# Altium project RelayBoard.PrjPcb
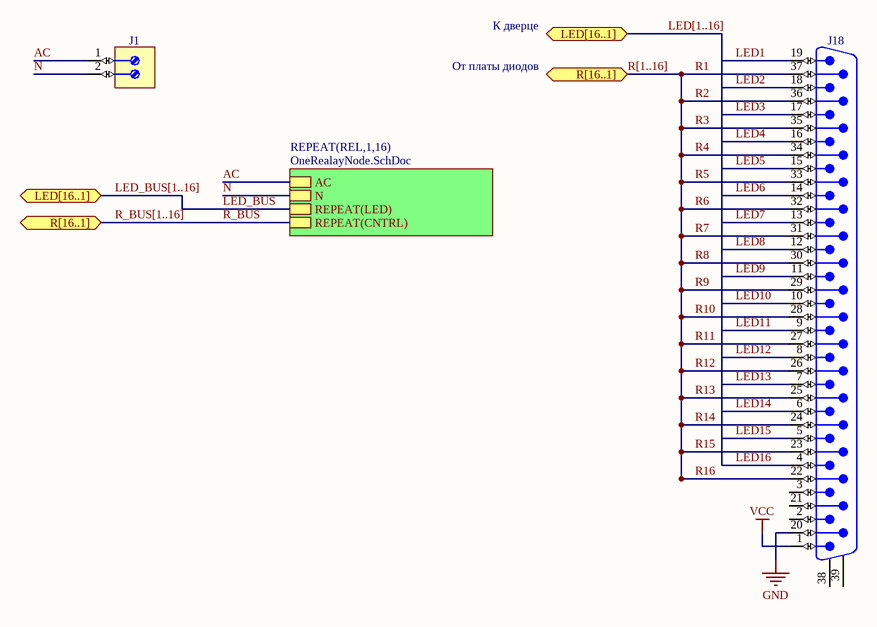
[diagram p0: RelayBoard.SchDoc]
2 sheets, 146 parts. Net scope: hierarchical (ports join the sheet entries above them; power ports are global).
Board file: RelayBoard.PcbDoc
Sheets:
  RelayBoard.SchDoc
    REL1 = OneRealayNode.SchDoc
    REL2 = OneRealayNode.SchDoc
    REL3 = OneRealayNode.SchDoc
    REL4 = OneRealayNode.SchDoc
    REL5 = OneRealayNode.SchDoc
    REL6 = OneRealayNode.SchDoc
    REL7 = OneRealayNode.SchDoc
    REL8 = OneRealayNode.SchDoc
    REL9 = OneRealayNode.SchDoc
    REL10 = OneRealayNode.SchDoc
    REL11 = OneRealayNode.SchDoc
    REL12 = OneRealayNode.SchDoc
    REL13 = OneRealayNode.SchDoc
    REL14 = OneRealayNode.SchDoc
    REL15 = OneRealayNode.SchDoc
    REL16 = OneRealayNode.SchDoc

## Sheet RelayBoard.SchDoc
size A1

### Parts
J1  Terminal  [WIELAND_25.161.0253.0]  (value not drawn)
J18  D-Sub  [AMPHENOL_L717DFC37P1ATN]  (value not drawn)

### Sub-sheets
REPEAT(REL,1,16) = OneRealayNode.SchDoc: AC, N, REPEAT(LED), REPEAT(CNTRL)

### Ports
LED[16..1], R[16..1]

### Nets
GND: J18.20
VCC: J18.1
AC: J1.1 ; sheet REPEAT(REL,1,16)/AC
LED1: J18.19  [also labelled LED_BUS1]
LED2: J18.18  [also labelled LED_BUS2]
LED3: J18.17  [also labelled LED_BUS3]
LED4: J18.16  [also labelled LED_BUS4]
LED5: J18.15  [also labelled LED_BUS5]
LED6: J18.14  [also labelled LED_BUS6]
LED7: J18.13  [also labelled LED_BUS7]
LED8: J18.12  [also labelled LED_BUS8]
LED9: J18.11  [also labelled LED_BUS9]
LED10: J18.10  [also labelled LED_BUS10]
LED11: J18.9  [also labelled LED_BUS11]
LED12: J18.8  [also labelled LED_BUS12]
LED13: J18.7  [also labelled LED_BUS13]
LED14: J18.6  [also labelled LED_BUS14]
LED15: J18.5  [also labelled LED_BUS15]
LED16: J18.4  [also labelled LED_BUS16]
LED_BUS: sheet REPEAT(REL,1,16)/REPEAT(LED)
N: J1.2 ; sheet REPEAT(REL,1,16)/N
R1: J18.37  [also labelled R_BUS1]
R2: J18.36  [also labelled R_BUS2]
R3: J18.35  [also labelled R_BUS3]
R4: J18.34  [also labelled R_BUS4]
R5: J18.33  [also labelled R_BUS5]
R6: J18.32  [also labelled R_BUS6]
R7: J18.31  [also labelled R_BUS7]
R8: J18.30  [also labelled R_BUS8]
R9: J18.29  [also labelled R_BUS9]
R10: J18.28  [also labelled R_BUS10]
R11: J18.27  [also labelled R_BUS11]
R12: J18.26  [also labelled R_BUS12]
R13: J18.25  [also labelled R_BUS13]
R14: J18.24  [also labelled R_BUS14]
R15: J18.23  [also labelled R_BUS15]
R16: J18.22  [also labelled R_BUS16]
R_BUS: sheet REPEAT(REL,1,16)/REPEAT(CNTRL)

Not connected (* = marked no-connect by the designer): J18 2 3 21 38 39

### Buses and harness runs
bus LED[1..16] = port LED[16..1]
bus LED_BUS[1..16] = port LED[16..1]
bus R[1..16] = port R[16..1]
bus R_BUS[1..16] = port R[16..1]

### Notes on the sheet
- К дверце
- От платы диодов

### Library data of the parts
J1 = WIELAND_25.161.0253.0: Terminal Block, 2 Positions, Screw Connection; Part Description: 16A 250VAC 2 Way PCB Terminal Block, Pitch 5mm, Screw Connection, Wire Size Max: 2.5mm²; Table: Miscellaneous; Part Number: WIELAND_25.161.0253.0; Component Kind: Standard; Component Type: Standard; Pin Count: 3; Family: Terminal; Mounted: Yes; Socket: No; SMD: No; Status: None; Manufacturer: WIELAND; Manufacturer Part Number: 25.161.0253.0; ComponentHeight: 15mm; HelpURL: \\cern.ch\dfs\Applications\Altium\Datasheets\WIELAND_25.161.0253.0.pdf; Author: CERN DEM JLC; CreateDate: 03.06.2009; LatestRevisionDate: 03.06.2009
J18 = AMPHENOL_L717DFC37P1ATN: Connector D-sub 37 Male; Part Description: Right Angled D-Sub 37 Male Contacts with Metal Bracket and Front Female Screwlock (UNC4-40); Part Number: AMPHENOL_L717DFC37P1ATN; Component Kind: Standard; Component Type: Standard; Pin Count: 39; Family: D-Sub; Mounted: Yes; Socket: No; SMD: No; Status: None; Manufacturer: AMPHENOL; Manufacturer Part Number: L717DFC37P1ATN; ComponentHeight: 13.4mm; HelpURL: \\cern.ch\dfs\Applications\Altium\Datasheets\AMPHENOL_L717DFC37P1ATN.pdf; Author: CERN DEM JLC; CreateDate: 27.09.2012; LatestRevisionDate: 27.09.2012; Table: AMPHENOL

## Sheet OneRealayNode.SchDoc
size A4
Used 16 times, as channels REL1, REL2, REL3, REL4, REL5, REL6, REL7, REL8, REL9, REL10, REL11, REL12, REL13, REL14, REL15, REL16. Parts and nets are listed once, with the designators drawn on the sheet.
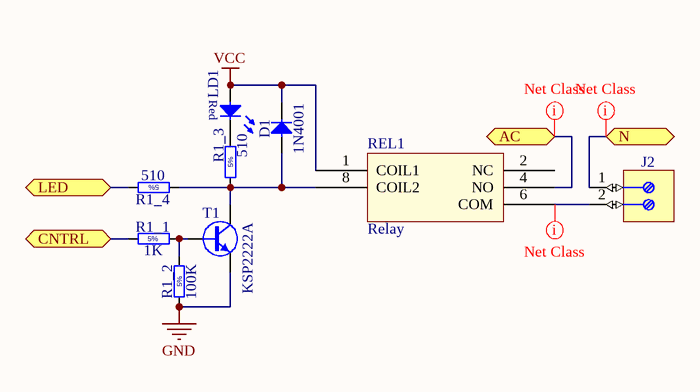
[diagram p1: OneRealayNode.SchDoc]

### Parts
D1  1N4001  [DO-41]
J2  Terminal  [WIELAND_25.161.0253.0]  (value not drawn)
LD1  Red  [LED_3MM_RED_1C-2A]  (value not drawn)
R1_1  1K  [RES_ARCOL_RCC025]
R1_2  100K  [RES_ARCOL_RCC025]
R1_3  510  [RES_ARCOL_RCC025]
R1_4  510  [RES_ARCOL_RCC025]
REL1  Relay  [RP78602]
T1  KSP2222A  [TO-92AA-P254]

### Ports
AC, CNTRL, LED, N

### Nets
GND: R1_2.1 T1.1(E)
VCC: D1.1(C) LD1.2(A) REL1.1(COIL1)
AC: REL1.4(NO) ; port AC
CNTRL: R1_1.1 ; port CNTRL
LED: R1_4.2 ; port LED
N: J2.1 ; port N
NetD1_2: D1.2(A) R1_3.1 R1_4.1 REL1.8(COIL2) T1.3(C)
NetJ2_2: J2.2 REL1.6(COM)
NetLD1_1: LD1.1(C) R1_3.2
NetR1_1_2: R1_1.2 R1_2.2 T1.2(B)

Not connected (* = marked no-connect by the designer): REL1 2(NC)

### Channels
REL1: designators D1=REL1_D1 J2=REL1_J2 LD1=REL1_LD1 R1_1=REL1_R1_1 R1_2=REL1_R1_2 R1_3=REL1_R1_3 R1_4=REL1_R1_4 REL1=REL1_REL1 T1=REL1_T1; ports AC=AC CNTRL=R1 LED=LED1 N=N
REL2: designators D1=REL2_D1 J2=REL2_J2 LD1=REL2_LD1 R1_1=REL2_R1_1 R1_2=REL2_R1_2 R1_3=REL2_R1_3 R1_4=REL2_R1_4 REL1=REL2_REL1 T1=REL2_T1; ports AC=AC CNTRL=R2 LED=LED2 N=N
REL3: designators D1=REL3_D1 J2=REL3_J2 LD1=REL3_LD1 R1_1=REL3_R1_1 R1_2=REL3_R1_2 R1_3=REL3_R1_3 R1_4=REL3_R1_4 REL1=REL3_REL1 T1=REL3_T1; ports AC=AC CNTRL=R3 LED=LED3 N=N
REL4: designators D1=REL4_D1 J2=REL4_J2 LD1=REL4_LD1 R1_1=REL4_R1_1 R1_2=REL4_R1_2 R1_3=REL4_R1_3 R1_4=REL4_R1_4 REL1=REL4_REL1 T1=REL4_T1; ports AC=AC CNTRL=R4 LED=LED4 N=N
REL5: designators D1=REL5_D1 J2=REL5_J2 LD1=REL5_LD1 R1_1=REL5_R1_1 R1_2=REL5_R1_2 R1_3=REL5_R1_3 R1_4=REL5_R1_4 REL1=REL5_REL1 T1=REL5_T1; ports AC=AC CNTRL=R5 LED=LED5 N=N
REL6: designators D1=REL6_D1 J2=REL6_J2 LD1=REL6_LD1 R1_1=REL6_R1_1 R1_2=REL6_R1_2 R1_3=REL6_R1_3 R1_4=REL6_R1_4 REL1=REL6_REL1 T1=REL6_T1; ports AC=AC CNTRL=R6 LED=LED6 N=N
REL7: designators D1=REL7_D1 J2=REL7_J2 LD1=REL7_LD1 R1_1=REL7_R1_1 R1_2=REL7_R1_2 R1_3=REL7_R1_3 R1_4=REL7_R1_4 REL1=REL7_REL1 T1=REL7_T1; ports AC=AC CNTRL=R7 LED=LED7 N=N
REL8: designators D1=REL8_D1 J2=REL8_J2 LD1=REL8_LD1 R1_1=REL8_R1_1 R1_2=REL8_R1_2 R1_3=REL8_R1_3 R1_4=REL8_R1_4 REL1=REL8_REL1 T1=REL8_T1; ports AC=AC CNTRL=R8 LED=LED8 N=N
REL9: designators D1=REL9_D1 J2=REL9_J2 LD1=REL9_LD1 R1_1=REL9_R1_1 R1_2=REL9_R1_2 R1_3=REL9_R1_3 R1_4=REL9_R1_4 REL1=REL9_REL1 T1=REL9_T1; ports AC=AC CNTRL=R9 LED=LED9 N=N
REL10: designators D1=REL10_D1 J2=REL10_J2 LD1=REL10_LD1 R1_1=REL10_R1_1 R1_2=REL10_R1_2 R1_3=REL10_R1_3 R1_4=REL10_R1_4 REL1=REL10_REL1 T1=REL10_T1; ports AC=AC CNTRL=R10 LED=LED10 N=N
REL11: designators D1=REL11_D1 J2=REL11_J2 LD1=REL11_LD1 R1_1=REL11_R1_1 R1_2=REL11_R1_2 R1_3=REL11_R1_3 R1_4=REL11_R1_4 REL1=REL11_REL1 T1=REL11_T1; ports AC=AC CNTRL=R11 LED=LED11 N=N
REL12: designators D1=REL12_D1 J2=REL12_J2 LD1=REL12_LD1 R1_1=REL12_R1_1 R1_2=REL12_R1_2 R1_3=REL12_R1_3 R1_4=REL12_R1_4 REL1=REL12_REL1 T1=REL12_T1; ports AC=AC CNTRL=R12 LED=LED12 N=N
REL13: designators D1=REL13_D1 J2=REL13_J2 LD1=REL13_LD1 R1_1=REL13_R1_1 R1_2=REL13_R1_2 R1_3=REL13_R1_3 R1_4=REL13_R1_4 REL1=REL13_REL1 T1=REL13_T1; ports AC=AC CNTRL=R13 LED=LED13 N=N
REL14: designators D1=REL14_D1 J2=REL14_J2 LD1=REL14_LD1 R1_1=REL14_R1_1 R1_2=REL14_R1_2 R1_3=REL14_R1_3 R1_4=REL14_R1_4 REL1=REL14_REL1 T1=REL14_T1; ports AC=AC CNTRL=R14 LED=LED14 N=N
REL15: designators D1=REL15_D1 J2=REL15_J2 LD1=REL15_LD1 R1_1=REL15_R1_1 R1_2=REL15_R1_2 R1_3=REL15_R1_3 R1_4=REL15_R1_4 REL1=REL15_REL1 T1=REL15_T1; ports AC=AC CNTRL=R15 LED=LED15 N=N
REL16: designators D1=REL16_D1 J2=REL16_J2 LD1=REL16_LD1 R1_1=REL16_R1_1 R1_2=REL16_R1_2 R1_3=REL16_R1_3 R1_4=REL16_R1_4 REL1=REL16_REL1 T1=REL16_T1; ports AC=AC CNTRL=R16 LED=LED16 N=N

### Layout directives
net class HighCurrent: AC, N, NetREL1_J2_2

### Notes on the sheet
- (in symbol RCF_5K1_5%_0.25W_+10-6PPM_ARCOL_RCC025) 5%

### Library data of the parts
D1 = 1N4007: Diode; Part Number: 1N4007; Part Description: Axial Lead Standard Recovery Rectifier; Manufacturer: FAIRCHILD SEMICONDUCTOR; Voltage: 1000V; Power: 1A; Table: Diodes; Component Kind: Standard; Component Type: Standard; Device: 1N4007; PackageDescription: DO-41, Diode, Axial, Body 4.7 x 2.7mm (LxDia. Max), Pin spacing 10.16mm; Manufacturer Part Number: 1N4007; Pin Count: 2; Case: DO-41; Mounted: Yes; Socket: No; SMD: No; ComponentHeight: 2.72mm; HelpURL: \\cern.ch\dfs\Applications\Altium\Datasheets\1N4007.pdf; ComponentLink1URL: \\cern.ch\dfs\Applications\Altium\Datasheets\1N4007_Package.pdf; ComponentLink1Description: Package Drawing; Author: CERN DEM JLC; CreateDate: 20.08.2008; LatestRevisionDate: 30.10.2013
J2 = WIELAND_25.161.0253.0: as J1 on sheet RelayBoard; Part Number: WIELAND_25.161.0253.0; Component Kind: Standard; Component Type: Standard; Pin Count: 3; Family: Terminal; Mounted: Yes; Socket: No; SMD: No; Status: None; Manufacturer: WIELAND; Manufacturer Part Number: 25.161.0253.0; ComponentHeight: 15mm; HelpURL: \\cern.ch\dfs\Applications\Altium\Datasheets\WIELAND_25.161.0253.0.pdf; Author: CERN DEM JLC; CreateDate: 03.06.2009; LatestRevisionDate: 03.06.2009
LD1 = LED_AVAGO_HLMP-1700: LED Red 1C 2A; Part Description: 3mm Red LED; Manufacturer: AVAGO TECHNOLOGIES; Table: LEDs & Displays; Part Number: LED_AVAGO_HLMP-1700; Component Kind: Standard; Component Type: Standard; Color: Red; PackageDescription: LED, Red, Body Dia. 3.43 mm, Pin spacing 2.54mm; Manufacturer Part Number: HLMP-1700; Pin Count: 2; Mounted: Yes; Socket: No; SMD: No; ComponentHeight: 6.35mm(min); HelpURL: \\cern.ch\dfs\Applications\Altium\Datasheets\LED_AVAGO_HLMP-1700.pdf; Author: CERN DEM JLC; CreateDate: 12.06.2008; LatestRevisionDate: 17.03.2010
R1_1-R1_4 = RCF_5K1_5%_0.25W_+10-6PPM_ARCOL_RCC025: Resistor - 5%; Part Description: Solid Carbon Resistor RCC Series; Manufacturer: ARCOL; Manufacturer Part Number: RCC025 5k1 J; Power: 0.25W; TC: +10-6ppm/°C; Table: Resistors THD; Part Number: RCF_5K1_5%_0.25W_+10-6PPM_ARCOL_RCC025; Component Kind: Standard; Component Type: Standard; Pin Count: 2; Status: None; Tolerance: ±5%; Case: LS10.16 L6.3 x D2.4; Mounted: Yes; Socket: No; SMD: No; ComponentHeight: 2.5mm; HelpURL: \\cern.ch\dfs\Applications\Altium\Datasheets\RCF_ARCOL_RCC025.pdf; Author: CERN DEM JLC; CreateDate: 30.10.2013; LatestRevisionDate: 30.10.2013
  R1_1: Value: 1K
  R1_2: Value: 100K
  R1_3 R1_4: Value: 510
T1 = ZTX653: NPN Transistor; Part Number: ZTX653; Part Description: 100V 2A NPN Silicon Planar Medium Power Transistor; Manufacturer: ZETEX SEMICONDUCTORS; Table: Transistors; Component Kind: Standard; Component Type: Standard; Device: ZTX653; PackageDescription: TO-92 (TO226), Pitch 2.54mm, Flat Index, 3 In-Line, Bent Leads, Body Dia. 5.3mm; Manufacturer Part Number: ZTX653; Pin Count: 3; Case: TO-92; Mounted: Yes; Socket: No; SMD: No; ComponentHeight: 7.7mm; HelpURL: \\cern.ch\dfs\Applications\Altium\Datasheets\ZTX653.pdf; Author: CERN DEM JMW; CreateDate: 30.11.2009; LatestRevisionDate: 30.11.2009

## Nets that join several sheets
GND: RelayBoard (J18.20), REL1 (REL1_R1_2.1 REL1_T1.1), REL2 (REL2_R1_2.1 REL2_T1.1), REL3 (REL3_R1_2.1 REL3_T1.1), REL4 (REL4_R1_2.1 REL4_T1.1), REL5 (REL5_R1_2.1 REL5_T1.1), REL6 (REL6_R1_2.1 REL6_T1.1), REL7 (REL7_R1_2.1 REL7_T1.1), REL8 (REL8_R1_2.1 REL8_T1.1), REL9 (REL9_R1_2.1 REL9_T1.1), REL10 (REL10_R1_2.1 REL10_T1.1), REL11 (REL11_R1_2.1 REL11_T1.1), REL12 (REL12_R1_2.1 REL12_T1.1), REL13 (REL13_R1_2.1 REL13_T1.1), REL14 (REL14_R1_2.1 REL14_T1.1), REL15 (REL15_R1_2.1 REL15_T1.1), REL16 (REL16_R1_2.1 REL16_T1.1)
VCC: RelayBoard (J18.1), REL1 (REL1_D1.1 REL1_LD1.2 REL1_REL1.1), REL2 (REL2_D1.1 REL2_LD1.2 REL2_REL1.1), REL3 (REL3_D1.1 REL3_LD1.2 REL3_REL1.1), REL4 (REL4_D1.1 REL4_LD1.2 REL4_REL1.1), REL5 (REL5_D1.1 REL5_LD1.2 REL5_REL1.1), REL6 (REL6_D1.1 REL6_LD1.2 REL6_REL1.1), REL7 (REL7_D1.1 REL7_LD1.2 REL7_REL1.1), REL8 (REL8_D1.1 REL8_LD1.2 REL8_REL1.1), REL9 (REL9_D1.1 REL9_LD1.2 REL9_REL1.1), REL10 (REL10_D1.1 REL10_LD1.2 REL10_REL1.1), REL11 (REL11_D1.1 REL11_LD1.2 REL11_REL1.1), REL12 (REL12_D1.1 REL12_LD1.2 REL12_REL1.1), REL13 (REL13_D1.1 REL13_LD1.2 REL13_REL1.1), REL14 (REL14_D1.1 REL14_LD1.2 REL14_REL1.1), REL15 (REL15_D1.1 REL15_LD1.2 REL15_REL1.1), REL16 (REL16_D1.1 REL16_LD1.2 REL16_REL1.1)
AC: RelayBoard (J1.1), REL1 (REL1_REL1.4), REL2 (REL2_REL1.4), REL3 (REL3_REL1.4), REL4 (REL4_REL1.4), REL5 (REL5_REL1.4), REL6 (REL6_REL1.4), REL7 (REL7_REL1.4), REL8 (REL8_REL1.4), REL9 (REL9_REL1.4), REL10 (REL10_REL1.4), REL11 (REL11_REL1.4), REL12 (REL12_REL1.4), REL13 (REL13_REL1.4), REL14 (REL14_REL1.4), REL15 (REL15_REL1.4), REL16 (REL16_REL1.4)
LED1: RelayBoard (J18.19), REL1 (REL1_R1_4.2)
LED2: RelayBoard (J18.18), REL2 (REL2_R1_4.2)
LED3: RelayBoard (J18.17), REL3 (REL3_R1_4.2)
LED4: RelayBoard (J18.16), REL4 (REL4_R1_4.2)
LED5: RelayBoard (J18.15), REL5 (REL5_R1_4.2)
LED6: RelayBoard (J18.14), REL6 (REL6_R1_4.2)
LED7: RelayBoard (J18.13), REL7 (REL7_R1_4.2)
LED8: RelayBoard (J18.12), REL8 (REL8_R1_4.2)
LED9: RelayBoard (J18.11), REL9 (REL9_R1_4.2)
LED10: RelayBoard (J18.10), REL10 (REL10_R1_4.2)
LED11: RelayBoard (J18.9), REL11 (REL11_R1_4.2)
LED12: RelayBoard (J18.8), REL12 (REL12_R1_4.2)
LED13: RelayBoard (J18.7), REL13 (REL13_R1_4.2)
LED14: RelayBoard (J18.6), REL14 (REL14_R1_4.2)
LED15: RelayBoard (J18.5), REL15 (REL15_R1_4.2)
LED16: RelayBoard (J18.4), REL16 (REL16_R1_4.2)
N: RelayBoard (J1.2), REL1 (REL1_J2.1), REL2 (REL2_J2.1), REL3 (REL3_J2.1), REL4 (REL4_J2.1), REL5 (REL5_J2.1), REL6 (REL6_J2.1), REL7 (REL7_J2.1), REL8 (REL8_J2.1), REL9 (REL9_J2.1), REL10 (REL10_J2.1), REL11 (REL11_J2.1), REL12 (REL12_J2.1), REL13 (REL13_J2.1), REL14 (REL14_J2.1), REL15 (REL15_J2.1), REL16 (REL16_J2.1)
R1: RelayBoard (J18.37), REL1 (REL1_R1_1.1)
R2: RelayBoard (J18.36), REL2 (REL2_R1_1.1)
R3: RelayBoard (J18.35), REL3 (REL3_R1_1.1)
R4: RelayBoard (J18.34), REL4 (REL4_R1_1.1)
R5: RelayBoard (J18.33), REL5 (REL5_R1_1.1)
R6: RelayBoard (J18.32), REL6 (REL6_R1_1.1)
R7: RelayBoard (J18.31), REL7 (REL7_R1_1.1)
R8: RelayBoard (J18.30), REL8 (REL8_R1_1.1)
R9: RelayBoard (J18.29), REL9 (REL9_R1_1.1)
R10: RelayBoard (J18.28), REL10 (REL10_R1_1.1)
R11: RelayBoard (J18.27), REL11 (REL11_R1_1.1)
R12: RelayBoard (J18.26), REL12 (REL12_R1_1.1)
R13: RelayBoard (J18.25), REL13 (REL13_R1_1.1)
R14: RelayBoard (J18.24), REL14 (REL14_R1_1.1)
R15: RelayBoard (J18.23), REL15 (REL15_R1_1.1)
R16: RelayBoard (J18.22), REL16 (REL16_R1_1.1)